# Altium schematic sheet PROC091F_PMIC.SchDoc: PMIC
size 431 x 279 mm; Date: Not shown in title block; ApprovedBy: Not shown in title block; CheckedBy: Not shown in title block; Author: Not shown in title block; CompanyName: Not shown in title block; DrawnBy: Antony/Bala; Engineer: Not shown in title block; Organization: Not shown in title block; Address1: Not shown in title block; Address2: Not shown in title block; Address3: Not shown in title block; Address4: Not shown in title block; DocumentNumber: 5; Revision: Use project parameter SCH_Rev; SheetNumber: 5; SheetTotal: 12; PageSetup: Record=PageOptions|CenterHorizontal=True|CenterVertical=True|PrintScale=1.00|XCorrection=1.00|YCorrection=1.00|PrintKind=0|BorderSize=5000000|LeftOffset=0|BottomOffset=0|Orientation=2|PaperLength=1000|PaperWidth=1000|Scale=100|PaperSource=15|PrintQuality=600|MediaType=1|DitherType=10|PaperKind=Letter|PrintScaleMode=1; CurrentTime: Not shown in title block; CurrentDate: Not shown in title block; Time: Not shown in title block; DocumentFullPathAndName: Not shown in title block; DocumentName: Not shown in title block; ModifiedDate: Not shown in title block; ImagePath: Not shown in title block
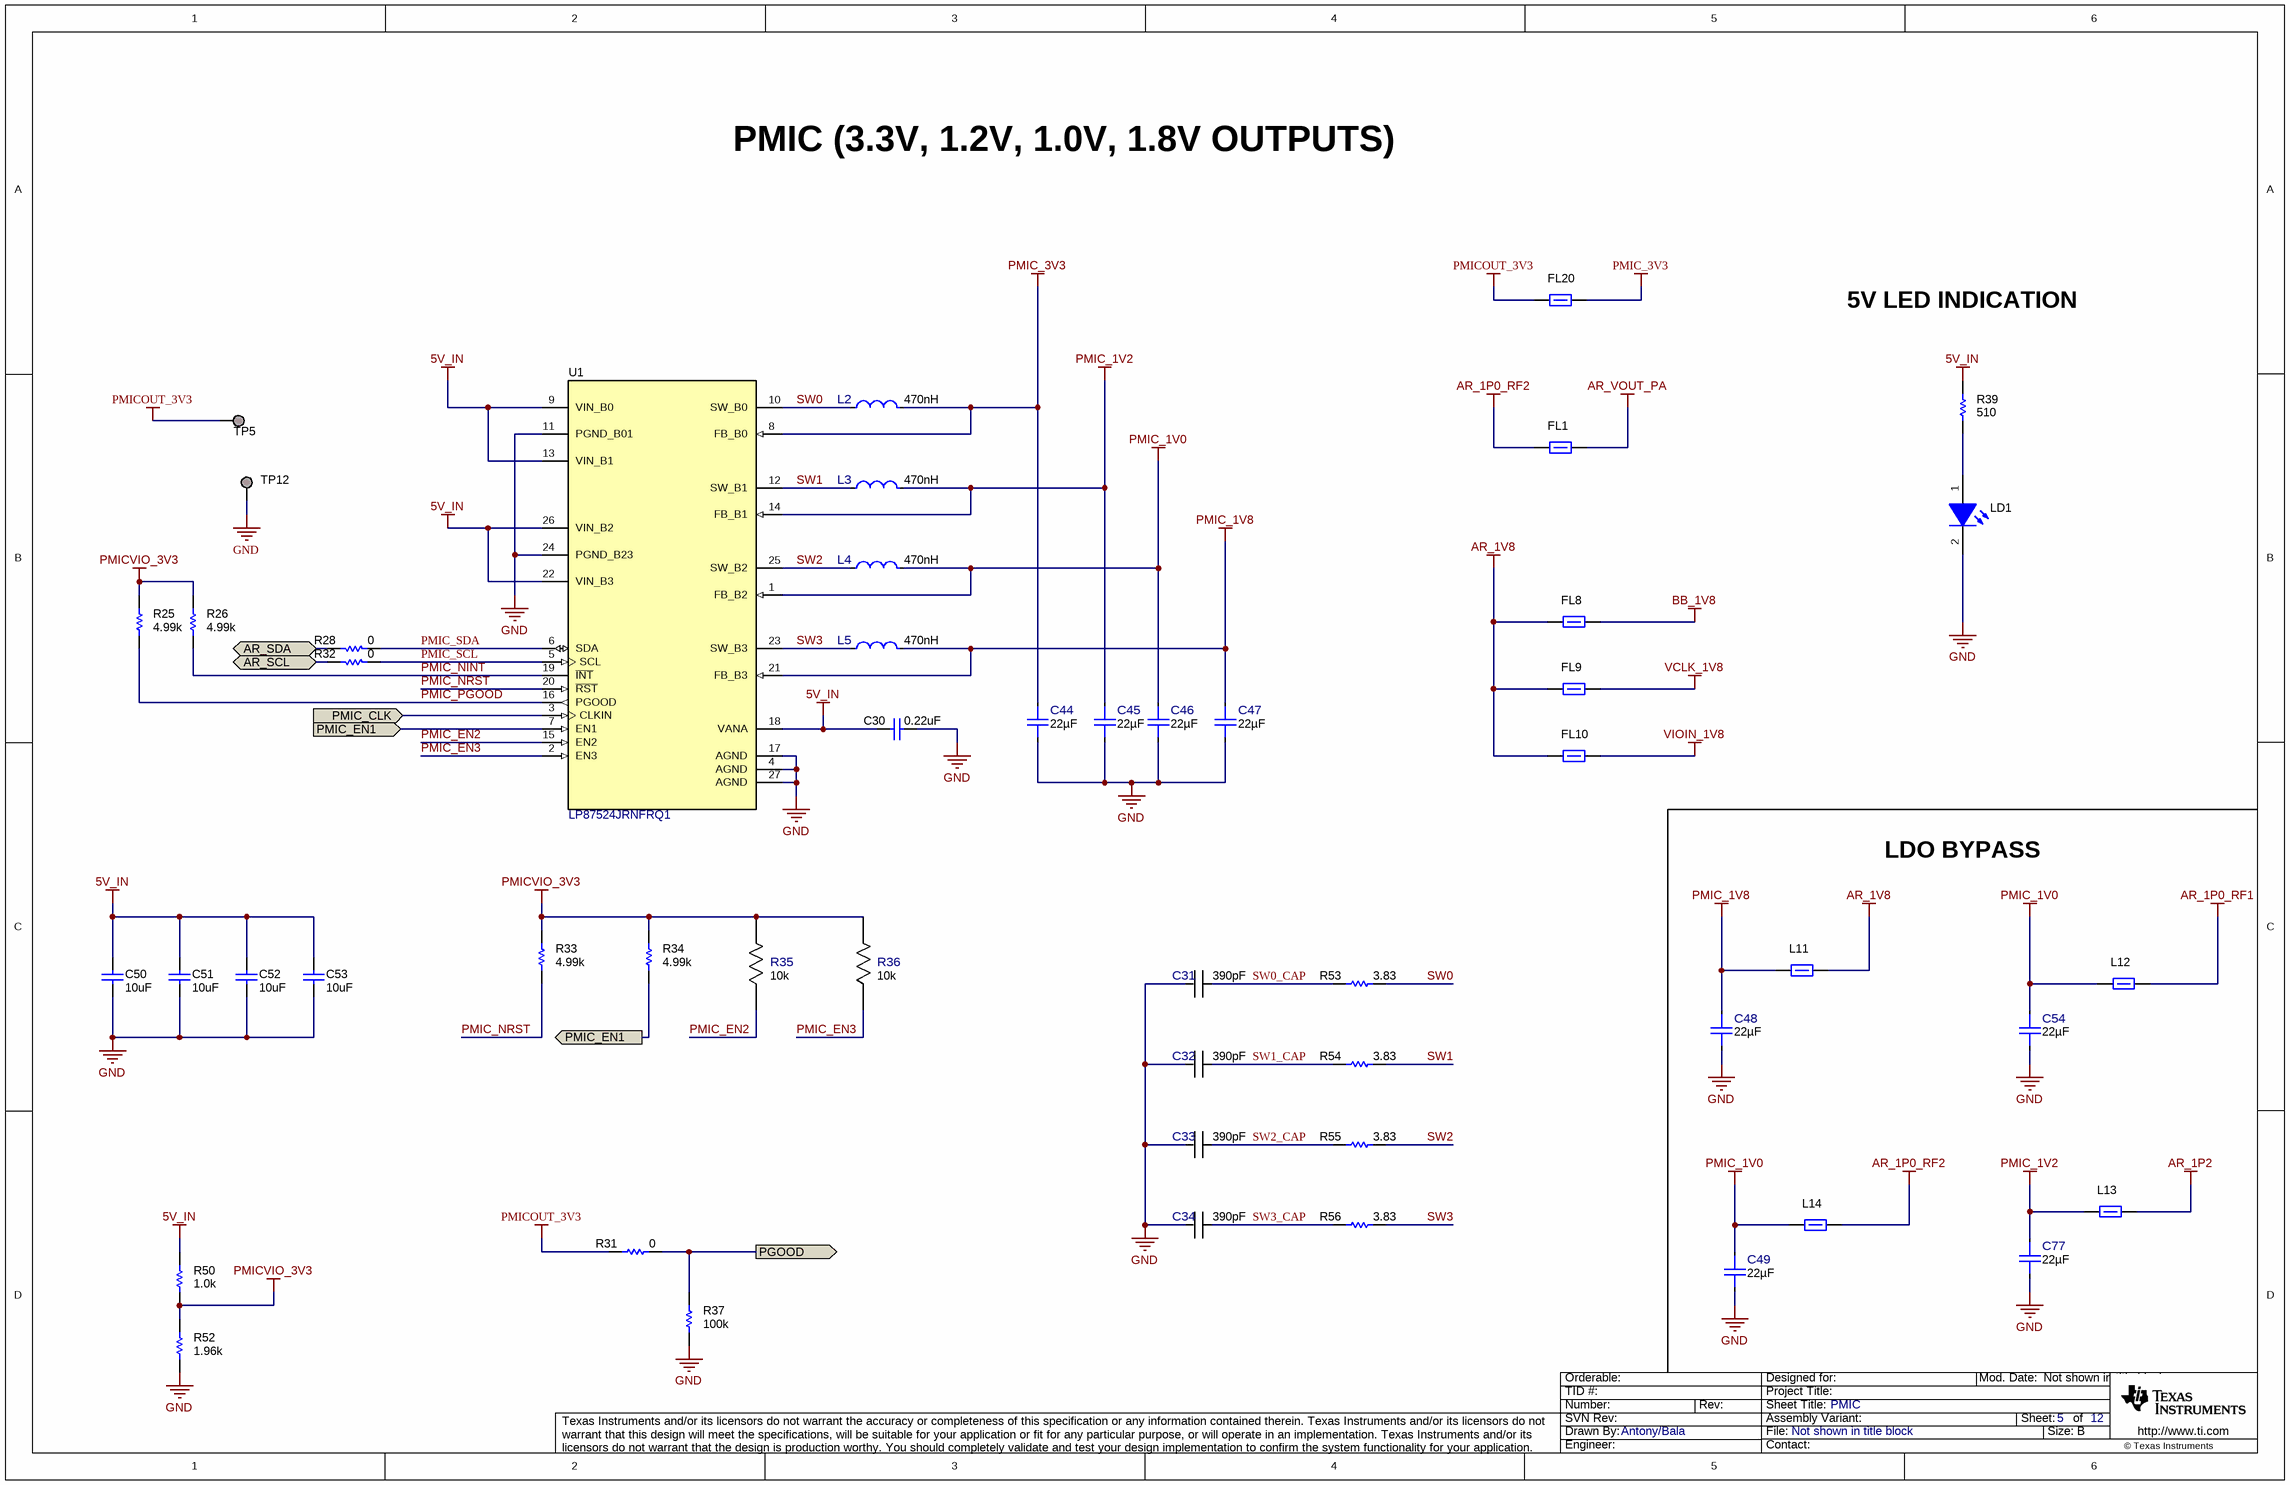
[diagram p0: PROC091F_PMIC.SchDoc]

## Parts
C30  value 0.22uF  [0201_033L]  (hidden comment: LMK063BJ224MP-F)
C31  Cap_F: 390pF  [FP-TMK063CG391JT-F_0201 (0603 Metric)-IPC_C]  (hidden comment: TMK063CG391JT-F)
C32  Cap_F: 390pF  [FP-TMK063CG391JT-F_0201 (0603 Metric)-IPC_C]  (hidden comment: TMK063CG391JT-F)
C33  Cap_F: 390pF  [FP-TMK063CG391JT-F_0201 (0603 Metric)-IPC_C]  (hidden comment: TMK063CG391JT-F)
C34  Cap_F: 390pF  [FP-TMK063CG391JT-F_0201 (0603 Metric)-IPC_C]  (hidden comment: TMK063CG391JT-F)
C44  Cap_F: 22µF  [FP-CL05A226MQ5N6J8_0402-IPC_C]  (hidden comment: CL05A226MQ5N6J8)
C45  Cap_F: 22µF  [FP-CL05A226MQ5N6J8_0402-IPC_C]  (hidden comment: CL05A226MQ5N6J8)
C46  Cap_F: 22µF  [FP-CL05A226MQ5N6J8_0402-IPC_C]  (hidden comment: CL05A226MQ5N6J8)
C47  Cap_F: 22µF  [FP-CL05A226MQ5N6J8_0402-IPC_C]  (hidden comment: CL05A226MQ5N6J8)
C48  Cap_F: 22µF  [FP-CL05A226MQ5N6J8_0402-IPC_C]  (hidden comment: CL05A226MQ5N6J8)
C49  Cap_F: 22µF  [FP-CL05A226MQ5N6J8_0402-IPC_C]  (hidden comment: CL05A226MQ5N6J8)
C50  value 10uF  [0402_070]  (hidden comment: CL05A106MP5NUNC)
C51  value 10uF  [0402_070]  (hidden comment: CL05A106MP5NUNC)
C52  value 10uF  [0402_070]  (hidden comment: CL05A106MP5NUNC)
C53  value 10uF  [0402_070]  (hidden comment: CL05A106MP5NUNC)
C54  Cap_F: 22µF  [FP-CL05A226MQ5N6J8_0402-IPC_C]  (hidden comment: CL05A226MQ5N6J8)
C77  Cap_F: 22µF  [FP-CL05A226MQ5N6J8_0402-IPC_C]  (hidden comment: CL05A226MQ5N6J8)
FL1  BLM15PD300SZ1D  [0402L]  (value not drawn)
FL8  BLM15PD300SZ1D  [0402L]  (value not drawn)
FL9  BLM15PD300SZ1D  [0402L]  (value not drawn)
FL10  BLM15PD300SZ1D  [0402L]  (value not drawn)
FL20  BLM15PD300SZ1D  [0402L]  (value not drawn)
L2  Ind_H: 470nH  [FP-MCKK2012TR47M_0805 (2012 Metric)-IPC_C]  (hidden comment: MCKK2012TR47M)
L3  Ind_H: 470nH  [FP-MCKK2012TR47M_0805 (2012 Metric)-IPC_C]  (hidden comment: MCKK2012TR47M)
L4  Ind_H: 470nH  [FP-MCKK2012TR47M_0805 (2012 Metric)-IPC_C]  (hidden comment: MCKK2012TR47M)
L5  Ind_H: 470nH  [FP-MCKK2012TR47M_0805 (2012 Metric)-IPC_C]  (hidden comment: MCKK2012TR47M)
L11  BLM18SG260TN1D  [0603L]  (value not drawn)
L12  BLM18SG260TN1D  [0603L]  (value not drawn)
L13  BLM18SG260TN1D  [0603L]  (value not drawn)
L14  BLM18SG260TN1D  [0603L]  (value not drawn)
LD1  APHHS1005CGCK  [APHHS1005_Green]  (value not drawn)
R25  value 4.99k  [0201L]  (hidden comment: RC0201FR-074K99L)
R26  value 4.99k  [0201L]  (hidden comment: RC0201FR-074K99L)
R28  Res_ohm: 0  [FP-RC0201JR-070RL_0201 (0603 Metric)-MFG]  (hidden comment: RC0201JR-070RL)
R31  Res_ohm: 0  [FP-RC0201JR-070RL_0201 (0603 Metric)-MFG]  (hidden comment: RC0201JR-070RL)
R32  Res_ohm: 0  [FP-RC0201JR-070RL_0201 (0603 Metric)-MFG]  (hidden comment: RC0201JR-070RL)
R33  value 4.99k  [0201L]  (hidden comment: RC0201FR-074K99L)
R34  value 4.99k  [0201L]  (hidden comment: RC0201FR-074K99L)
R35  Res_ohm: 10k  [FP-RR0306P-103-D_0201-IPC_C]  (hidden comment: RR0306P-103-D)
R36  Res_ohm: 10k  [FP-RR0306P-103-D_0201-IPC_C]  (hidden comment: RR0306P-103-D)
R37  value 100k  [0201L]  (hidden comment: CRCW0201100KFKED)
R39  value 510  [0201L]  (hidden comment: RC0201JR-07510RL)
R50  value 1.0k  [0201L]  (hidden comment: RC0201JR-071KL)
R52  value 1.96k  [0201L]  (hidden comment: RC0201FR-071K96L)
R53  Res_ohm: 3.83  [FP-RC0402FR-073R83L_0402 (1005 Metric)-IPC_C]  (hidden comment: RC0402FR-073R83L)
R54  Res_ohm: 3.83  [FP-RC0402FR-073R83L_0402 (1005 Metric)-IPC_C]  (hidden comment: RC0402FR-073R83L)
R55  Res_ohm: 3.83  [FP-RC0402FR-073R83L_0402 (1005 Metric)-IPC_C]  (hidden comment: RC0402FR-073R83L)
R56  Res_ohm: 3.83  [FP-RC0402FR-073R83L_0402 (1005 Metric)-IPC_C]  (hidden comment: RC0402FR-073R83L)
TP5  TESTPOINT  [TP_25MIL-SMT]  (value not drawn)  (no BOM)
TP12  TESTPOINT  [TP_VIA_060RND040]  (value not drawn)  (no BOM)
U1  LP87524JRNFRQ1  [RNF0026C]

## Ports
AR_SCL (bidir), AR_SDA (bidir), PGOOD (out), PMIC_CLK (in), PMIC_EN1 (in), PMIC_EN1 (out)

## Nets
5V_IN: C30.1 C50.1 C51.1 C52.1 C53.1 R39.1 R50.2 U1.9(VIN_B0) U1.13(VIN_B1) U1.18(VANA) U1.22(VIN_B3) U1.26(VIN_B2)
AR_1P0_RF1: L12.2
AR_1P0_RF2: FL1.1 L14.2
AR_1P2: L13.2
AR_1V8: FL8.1 FL9.1 FL10.1 L11.2
AR_VOUT_PA: FL1.2
BB_1V8: FL8.2
GND: C30.2 C31.2 C32.2 C33.2 C34.2 C44.2 C45.2 C46.2 C47.2 C48.2 C49.2 C50.2 C51.2 C52.2 C53.2 C54.2 C77.2 LD1.2(K) R37.1 R52.1 TP12.1 U1.4(AGND) U1.11(PGND_B01) U1.17(AGND) U1.24(PGND_B23) U1.27(AGND)
PMIC_1V0: C46.1 C49.1 C54.1 L4.1 L12.1 L14.1 U1.1(FB_B2)
PMIC_1V2: C45.1 C77.1 L3.1 L13.1 U1.14(FB_B1)
PMIC_1V8: C47.1 C48.1 L5.1 L11.1 U1.21(FB_B3)
PMIC_3V3: C44.1 FL20.2 L2.1 U1.8(FB_B0)
PMICOUT_3V3: FL20.1 R31.2 TP5.1
PMICVIO_3V3: R25.2 R26.2 R33.2 R34.2 R35.2 R36.2 R50.1 R52.2
VCLK_1V8: FL9.2
VIOIN_1V8: FL10.2
AR_SCL: R32.1 ; port AR_SCL
AR_SDA: R28.1 ; port AR_SDA
PGOOD: R31.1 R37.2 ; port PGOOD
PMIC_CLK: U1.3(CLKIN) ; port PMIC_CLK
PMIC_EN1: R34.1 U1.7(EN1) ; port PMIC_EN1
PMIC_EN2: R35.1 U1.15(EN2)
PMIC_EN3: R36.1 U1.2(EN3)
PMIC_NINT: R26.1 U1.19(~{INT})
PMIC_NRST: R33.1 U1.20(~{RST})
PMIC_PGOOD: R25.1 U1.16(PGOOD)
PMIC_SCL: R32.2 U1.5(SCL)
PMIC_SDA: R28.2 U1.6(SDA)
SW0: L2.2 R53.2 U1.10(SW_B0)
SW0_CAP: C31.1 R53.1
SW1: L3.2 R54.2 U1.12(SW_B1)
SW1_CAP: C32.1 R54.1
SW2: L4.2 R55.2 U1.25(SW_B2)
SW2_CAP: C33.1 R55.1
SW3: L5.2 R56.2 U1.23(SW_B3)
SW3_CAP: C34.1 R56.1
NetLD1_1: LD1.1(A) R39.2

## Notes on the sheet
- PMIC (3.3V, 1.2V, 1.0V, 1.8V OUTPUTS)
- 5V LED INDICATION
- LDO BYPASS
- Drawn By:
- SVN Rev:
- Number:
- TID #:
- Orderable:
- Rev:
- Sheet Title:
- File:
- Project Title:
- Designed for:
- Assembly Variant:
- Mod. Date:
- Sheet:
- Size:
- of
- B
- http://www.ti.com
- Texas Instruments and/or its licensors do not warrant the accuracy or completeness of this specification or any information contained therein. Texas Instruments and/or its licensors do not warrant that this design will meet the specifications, will be suitable for your application or fit for any particular purpose, or will operate in an implementation. Texas Instruments and/or its licensors do not warrant that the design is production worthy. You should completely validate and test your design implementation to confirm the system functionality for your application.
- Engineer:
- Contact:
- © Texas Instruments

## Library data of the parts
C30 = CMP-0009781-1: CAP, CERM, 0.22 uF, 10 V, +/- 20%, X5R, 0201; Manufacturer: Taiyo Yuden; AEC Category: Q200; AEC Qualified: N; Cap_Case: 0201; Cap_F: 220nF; SizeArea_mm2: 0.18; SizeAreaWB_mm2: 2.08; SizeX_mm: 0.6; SizeY_mm: 0.3; SizeZ_mm: 0.33; TaMax_C: 85°C; TaMin_C: -55°C; U/M: EA; Value1: Unknown; Value2: 10V; RoHS: Y; AEC Grade: N/A; ComponentLink1Description: Datasheet link; ComponentLink1URL: http://www.yuden.co.jp/productdata/catalog/en/mlcc_all_e.pdf; CompType: Capacitor; LatestRevisionDate: 2017-03-09; MountType: SMT; PackageReference: 0201; PartNumber: LMK063BJ224MP-F; Polarized: N; Published: 2008-06-19; Publisher: Texas Instruments; Supplier 1: Digi-Key; Supplier 2: Newark; Supplier 3: Mouser; Supplier Part Number 1: 587-2483-1-ND; Supplier Part Number 2: 48T3327; Supplier Part Number 3: 963-LMK063BJ224MP-F; Technology: Ceramic; TempCo: X5R; Tolerance_%: 20%; ValueDisplayed: 0.22uF; VDC_V: 10V
C31-C34 = CMP-0086438-1: CAP CER 390PF 25V C0G/NP0 0201; Manufacturer: Taiyo Yuden; AEC Qualified: No; SizeZ_mm: 0.33mm; Symbol Name: SYM-TMK063CG391JT-F; TempCo: 30ppm/°C; Tolerance_%: 5%; RoHS: TRUE; ComponentLink1Description: Datasheet; ComponentLink1URL: https://ds.yuden.co.jp/TYCOMPAS/ut/download?pn=TMK063CG391JT-F+&fileType=CA; PackageReference: 0201 (0603 Metric); PartNumber: TMK063CG391JT-F; VDC_V: 25V
C44-C47 = CMP-0089043-3: CAP CER 22UF 6.3V X5R 0402; Manufacturer: Samsung Electro-Mechanics; AEC Qualified: No; SizeZ_mm: 0.55mm; TempCo: 15%; Tolerance_%: 20%; RoHS: TRUE; ComponentLink1Description: Datasheet; ComponentLink1URL: http://www.samsungsem.com/kr/support/library/product-catalog/__icsFiles/afieldfile/2018/11/28/MLCC.pdf; PackageReference: 0402; PartNumber: CL05A226MQ5N6J8; VDC_V: 6.3V; ValueDisplayed: 22uF; Part Number: CL05A226MQ5N6J8
C48 C49 C54 C77 = CMP-0089043-3: CAP CER 22UF 6.3V X5R 0402; Manufacturer: Samsung Electro-Mechanics; TempCo: 15%; AEC Qualified: No; Tolerance_%: 20%; SizeZ_mm: 0.55mm; ComponentLink1URL: http://www.samsungsem.com/kr/support/library/product-catalog/__icsFiles/afieldfile/2018/11/28/MLCC.pdf; RoHS: TRUE; PartNumber: CL05A226MQ5N6J8; ComponentLink1Description: Datasheet; PackageReference: 0402; VDC_V: 6.3V; ValueDisplayed: 22uF; Part Number: CL05A226MQ5N6J8
C50-C53 = CMP-0006339-4: CAP, CERM, 10 uF, 10 V, +/- 20%, X5R, 0402; Manufacturer: Samsung Electro-Mechanics; AEC Category: Q200; AEC Qualified: N; Cap_Case: 0402; Cap_F: 10µF; SizeArea_mm2: 0.5; SizeAreaWB_mm2: 3; SizeX_mm: 1; SizeZ_mm: 0.6; TaMax_C: 85°C; TaMin_C: -55°C; U/M: EA; Value1: Unknown; Value2: 10V; RoHS: Y; AEC Grade: N/A; ComponentLink1Description: Datasheet link; ComponentLink1URL: http://www.samsungsem.com/kr/support/product-search/mlcc/__icsFiles/afieldfile/2018/06/21/CL05A106MP5NUNC.pdf; CompType: Capacitor; MountType: SMT; PackageReference: 0402; PartNumber: CL05A106MP5NUNC; Polarized: N; SizeY_mm: 0.5; Technology: Ceramic; TempCo: X5R; Tolerance_%: 20%; ValueDisplayed: 10uF; VDC_V: 10V
FL1 FL8-FL10 FL20 = CMP-0078934-1: Inductor, Ferrite Bead, Ferrite, 2.2 A, 0.035 ohm, AEC-Q200 Grade 1, SMD; Manufacturer: MuRata; AEC Category: Q200; AEC Grade: 1; AEC Qualified: Y; DCR_ohm: 0.035; Imax_A: 2.2A; SizeArea_mm2: 0.5; SizeAreaWB_mm2: 3; SizeZ_mm: 0.6; RoHS: Y; ComponentLink1Description: Datasheet link; ComponentLink1URL: https://www.murata.com/en-us/products/productdata/8796748677150/QNFA9118.pdf; CompType: Inductor; LatestRevisionDate: 2017-12-07; Material: Ferrite; MountType: SMT; PackageReference: 0402; PartNumber: BLM15PD300SZ1D; Published: 2008-06-26; Publisher: Texas Instruments; SizeX_mm: 1; SizeY_mm: 0.5; Supplier 1: Digi-Key; Supplier 2: Mouser; Supplier Part Number 1: 490-16506-1-ND; Supplier Part Number 2: 81-BLM15PD300SZ1D; Technology: Ferrite Bead; Value1: 0.035 ohm; Value2: 2.2A
L2-L5 = CMP-0087178-1: FIXED IND 470NH 4.5A 39 MOHM SMD; Manufacturer: Taiyo Yuden; AEC Qualified: No; DCR_ohm: 0.032; Irms: 3.1A; Material: Metal; SizeZ_mm: 1mm; Symbol Name: SYM-MCKK2012TR47M; RoHS: TRUE; ComponentLink1Description: Datasheet; ComponentLink1URL: https://ds.yuden.co.jp/TYCOMPAS/ut/download?pn=MCKK2012TR47M&fileType=CS; Isat: 4.5A; PackageReference: 0805 (2012 Metric); PartNumber: MCKK2012TR47M; Technology: Multilayer
L11-L14 = CMP-0003354-2: Ferrite Bead, 26 ohm @ 100 MHz, 6 A, 0603; Manufacturer: MuRata; ZTyp@100MHz_Ohm: 26; SizeAreaWB_mm2: 4.68; DCR_ohm: 7m; Value1: 0.007 ohm; Value: 26 ohm; Imax_A: 6A; SizeZ_mm: 1; SizeX_mm: 1.6; SizeY_mm: 0.8; SizeArea_mm2: 1.28; ComponentLink1URL: http://search.murata.co.jp/Ceramy/image/img/PDF/ENG/L0110S0100BLM18S.pdf; Supplier Part Number 2: 73M9124; Publisher: Texas Instruments; Supplier 2: Newark; Supplier Part Number 3: 81-BLM18SG260TN1D; Supplier 3: Mouser; Published: 2014-04-30; RoHS: Y; MountType: SMT; Supplier 1: Digi-Key; PackageReference: 0603; Value2: 6A; CompType: Ferrite Bead; LatestRevisionDate: 2017-03-09; PartNumber: BLM18SG260TN1D; ComponentLink1Description: Datasheet link; Supplier Part Number 1: 490-3995-1-ND; ValueDisplayed: 26 ohm
LD1 = CMP-0067682-2: LED, Green, SMD; Manufacturer: Kingbright; Angle: 120.0; Power_TotalModule: 75mW; SizeZ_mm: 0.6; Vf_V: 2.1V; Vr_V: 5V; Io_A: 20mA; Ir_A: 10µA; SizeArea_mm2: 0.5; SizeAreaWB_mm2: 3.0; SizeX_mm: 1.0; Tjmax_C: 85°C; Value1: 0.075W; RoHS: Y; Color: Green; ComponentLink1Description: Datasheet link; ComponentLink1URL: http://www.kingbrightusa.com/images/catalog/SPEC/APHHS1005CGCK.pdf; PackageReference: 0402; PartNumber: APHHS1005CGCK; CompType: LED; MountType: SMT; SizeY_mm: 0.5; Type: ?; Value2: 2.1V; Value: Green
R25 R26 R33 R34 = CMP-0027745-1: RES, 4.99 k, 1%, 0.05 W, 0201; Manufacturer: Yageo America; AEC Category: Q200; AEC Qualified: N; EIA_Code: E96; Power_W: 50mW; SizeArea_mm2: 0.18; SizeX_mm: 0.6; SizeY_mm: 0.3; SizeZ_mm: 0.26; TempCo: 200 ppm/C; U/M: EA; Value2: 0.05W; Value_Code: 4k99; VDC_V: 25V; RoHS: Y; AEC Grade: N/A; ComponentLink1Description: Datasheet link; ComponentLink1URL: http://www.yageo.com/documents/recent/PYu-RC_Group_51_RoHS_L_5.pdf; CompType: Resistor; LatestRevisionDate: 2017-03-09; MountType: SMT; PackageReference: 0201; PartNumber: RC0201FR-074K99L; Published: 2016-10-14; Publisher: Texas Instruments; Res_ohm: 4.99k; Supplier 1: Digi-Key; Supplier 2: Mouser; Supplier Part Number 1: YAG2712CT-ND; Supplier Part Number 2: 603-RC0201FR-074K99L; Technology: Thick Film; Tolerance_%: 1%; Value1: 1%; ValueDisplayed: 4.99k
R28 R31 R32 = CMP-0086442-2: RES SMD 0 OHM JUMPER 1/20W 0201; Manufacturer: Yageo; AEC Qualified: No; Power_W: 50mW; SizeZ_mm: 0.26mm; TempCo: 200ppm/°C; Tolerance_%: 5%; VDC_V: 25V; RoHS: TRUE; ComponentLink1Description: Datasheet; ComponentLink1URL: http://www.yageo.com/documents/recent/PYu-RC_Group_51_RoHS_L_10.pdf; PackageReference: 0201 (0603 Metric); PartNumber: RC0201JR-070RL; Technology: Thick Film
R35 R36 = CMP-0088002-1: 10 kOhms ±0.5% 0.05W, 1/20W Chip Resistor 0201 (0603 Metric)  Thin Film; Manufacturer: Susumu; AEC Qualified: No; Power_W: 50mW; SizeZ_mm: 0.26mm; Symbol Name: SYM-RR0306P-103-D; TempCo: 25ppm/°C; VDC_V: 15V; RoHS: TRUE; ComponentLink1Description: Datasheet; ComponentLink1URL: https://www.susumu.co.jp/common/pdf/n_catalog_partition05_en.pdf; PackageReference: 0201; PartNumber: RR0306P-103-D; Technology: Thin Film; Tolerance_%: 0.5%
R37 = CMP-0027261-3: RES, 100 k, 1%, 0.05 W, 0201; Manufacturer: Vishay-Dale; AEC Category: Q200; AEC Qualified: N; EIA_Code: E96; Power_W: 50mW; SizeArea_mm2: 0.18; SizeX_mm: 0.6; SizeY_mm: 0.3; SizeZ_mm: 0.26; TempCo: 100 ppm/C; Value2: 0.05W; VDC_V: 30V; RoHS: E; AEC Grade: N/A; ComponentLink1Description: Datasheet link; ComponentLink1URL: http://www.vishay.com/docs/20052/crcw0201e3.pdf; CompType: Resistor; MountType: SMT; PackageReference: 0201; PartNumber: CRCW0201100KFKED; Res_ohm: 100k; Supplier 1: Digi-Key; Supplier 2: Newark; Supplier 3: Mouser; Supplier Part Number 1: 541-100KAABCT-ND; Supplier Part Number 2: 84R1457; Supplier Part Number 3: 71-CRCW0201100KFKED; Technology: Thick Film; Tolerance_%: 1%; Value1: 1%; Value_Code: 100k; ValueDisplayed: 100k
R39 = CMP-0027137-1: RES, 510, 5%, 0.05 W, 0201; Manufacturer: Yageo America; AEC Category: Q200; AEC Qualified: N; EIA_Code: E24; Power_W: 50mW; SizeArea_mm2: 0.18; SizeX_mm: 0.6; SizeY_mm: 0.3; SizeZ_mm: 0.26; TempCo: 200 ppm/C; U/M: EA; Value2: 0.05W; Value_Code: 510R; VDC_V: 25V; RoHS: Y; AEC Grade: N/A; ComponentLink1Description: Datasheet link; ComponentLink1URL: http://www.yageo.com/documents/recent/PYu-RC_Group_51_RoHS_L_5.pdf; CompType: Resistor; LatestRevisionDate: 2017-03-09; MountType: SMT; PackageReference: 0201; PartNumber: RC0201JR-07510RL; Published: 2016-10-14; Publisher: Texas Instruments; Res_ohm: 510; Supplier 1: Digi-Key; Supplier 2: Mouser; Supplier Part Number 1: YAG2907CT-ND; Supplier Part Number 2: 603-RC0201JR-07510RL; Technology: Thick Film; Tolerance_%: 5%; Value1: 5%; ValueDisplayed: 510
R50 = CMP-0027052-1: RES, 1.0 k, 5%, 0.05 W, 0201; Manufacturer: Yageo America; AEC Category: Q200; AEC Qualified: N; EIA_Code: E24; Power_W: 50mW; Res_ohm: 1k; SizeArea_mm2: 0.18; SizeX_mm: 0.6; SizeY_mm: 0.3; SizeZ_mm: 0.26; TempCo: 200 ppm/C; U/M: EA; Value2: 0.05W; Value_Code: 1k00; VDC_V: 25V; RoHS: Y; AEC Grade: N/A; ComponentLink1Description: Datasheet link; ComponentLink1URL: http://www.yageo.com/documents/recent/PYu-RC_Group_51_RoHS_L_5.pdf; CompType: Resistor; LatestRevisionDate: 2017-03-09; MountType: SMT; PackageReference: 0201; PartNumber: RC0201JR-071KL; Published: 2016-10-14; Publisher: Texas Instruments; Supplier 1: Digi-Key; Supplier 2: Mouser; Supplier Part Number 1: 311-1KNCT-ND; Supplier Part Number 2: 603-RC0201JR-071KL; Technology: Thick Film; Tolerance_%: 5%; Value1: 5%; ValueDisplayed: 1.0k
R52 = CMP-0027452-1: RES, 1.96 k, 1%, 0.05 W, 0201; Manufacturer: Yageo America; AEC Category: Q200; AEC Qualified: N; EIA_Code: E96; Power_W: 50mW; SizeArea_mm2: 0.18; SizeX_mm: 0.6; SizeY_mm: 0.3; SizeZ_mm: 0.26; TempCo: 200 ppm/C; U/M: EA; Value2: 0.05W; Value_Code: 1k96; VDC_V: 25V; RoHS: Y; AEC Grade: N/A; ComponentLink1Description: Datasheet link; ComponentLink1URL: http://www.yageo.com/documents/recent/PYu-RC_Group_51_RoHS_L_5.pdf; CompType: Resistor; LatestRevisionDate: 2017-03-09; MountType: SMT; PackageReference: 0201; PartNumber: RC0201FR-071K96L; Published: 2016-10-14; Publisher: Texas Instruments; Res_ohm: 1.96k; Supplier 1: Digi-Key; Supplier 2: Mouser; Supplier Part Number 1: YAG2494CT-ND; Supplier Part Number 2: 603-RC0201FR-071K96L; Technology: Thick Film; Tolerance_%: 1%; Value1: 1%; ValueDisplayed: 1.96k
R53-R56 = CMP-0086444-2: RES Thick Film SMD 3.83Ω 1% 1/16W 0402 200ppm/°C; Manufacturer: Yageo; AEC Qualified: No; Power_W: 63mW; VDC_V: 50V; SizeZ_mm: 0.4mm; ComponentLink1Description: Datasheet; PackageReference: 0402 (1005 Metric); TempCo: 200ppm/°C; RoHS: TRUE; Technology: Thick Film; PartNumber: RC0402FR-073R83L; ComponentLink1URL: http://www.yageo.com/documents/recent/PYu-RC_Group_51_RoHS_L_10.pdf; Tolerance_%: 1%
TP5 TP12 = CMP-0078143-3: TEST POINT.  No entry in BOM.; CompType: Testpoint; Manufacturer: N/A; PackageReference: N/A; PartNumber: N/A; Library Reference: TESTPOINT
U1 = CMP-0079120-2: 4-A + 2.5-A + Two 1.5-A Buck Converters With Integrated Switches, RNF0026C (VQFN-HR-26); Alternate PartNumber: LP87524JRNFTQ1; Alternate Manufacturer: Texas Instruments; SizeAreaWB_mm2: 27.5; SizeZ_mm: 0.9; SizeX_mm: 4; SizeY_mm: 4.5; SizeArea_mm2: 18; CompType: IC; AEC Qualified: Y; AEC Category: Q200; ComponentLink1URL: http://www.ti.com/lit/ds/symlink/lp87524-q1.pdf; PackageDescription: VQFN-HR-26; RoHS: Y; MountType: SMT; ComponentLink2URL: http://www.ti.com/product/lp87524-q1; ComponentLink2Description: Product Folder; Manufacturer: Texas Instruments; PackageReference: RNF0026C; ComponentLink1Description: Datasheet Link; PartNumber: LP87524JRNFRQ1